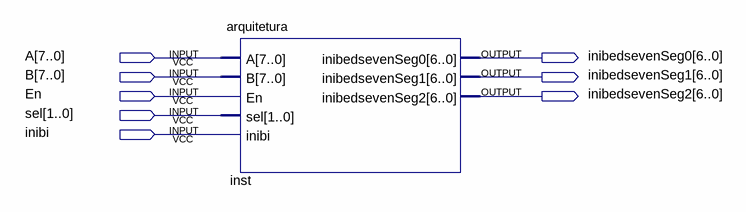
[diagram p0: schematic sheet]
// Quartus schematic atv06.bdf as structural Verilog: 1 symbols, 8 pins
module atv06 (
  input  [7:0] A,
  input  [7:0] B,
  input  En,
  input  [1:0] sel,
  input  inibi,
  output [6:0] inibedsevenSeg0,
  output [6:0] inibedsevenSeg1,
  output [6:0] inibedsevenSeg2
);

  arquitetura inst (
    .A(A), .B(B), .En(En), .sel(sel), .inibi(inibi), .inibedsevenSeg0(inibedsevenSeg0),
    .inibedsevenSeg1(inibedsevenSeg1), .inibedsevenSeg2(inibedsevenSeg2));
endmodule
